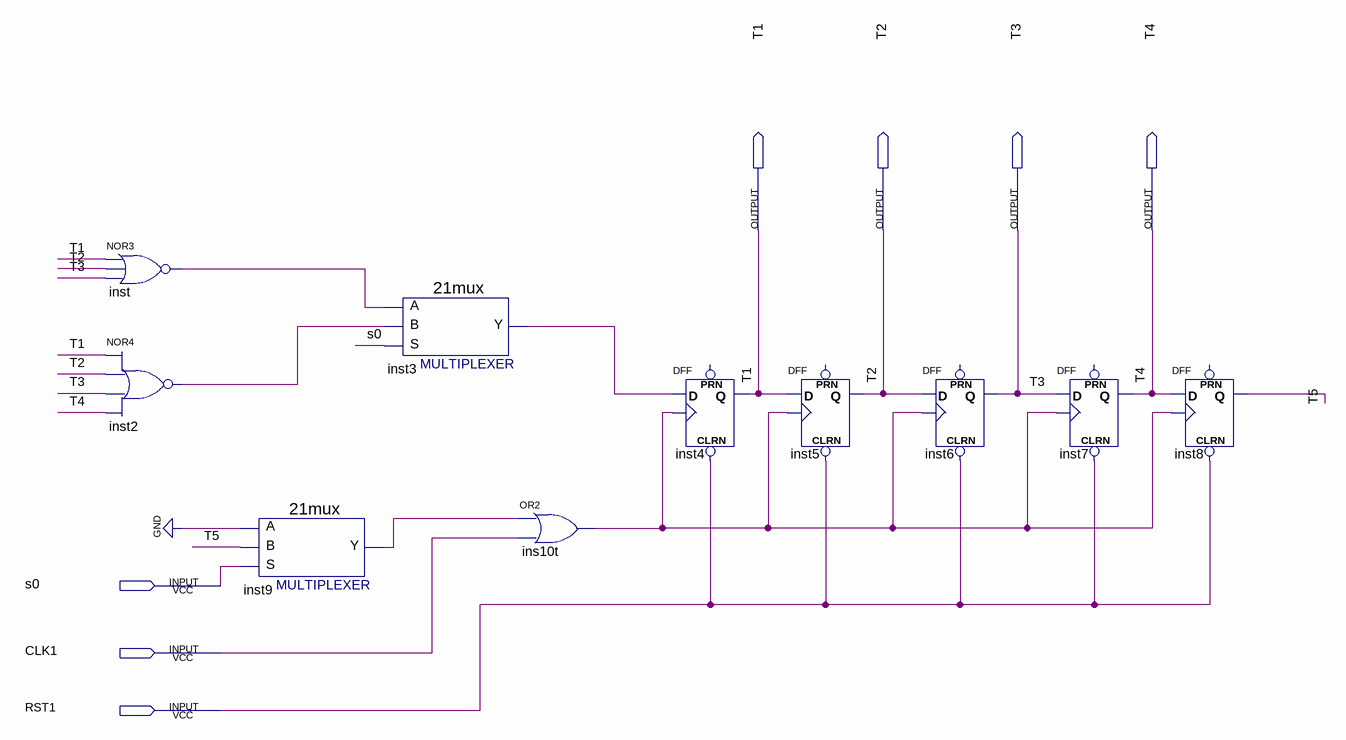
[diagram p0: schematic sheet]
// Quartus schematic Timig2627.bdf as structural Verilog: 10 symbols, 7 pins
module Timig2627 (
  input  s0,
  input  CLK1,
  input  RST1,
  output T1,
  output T2,
  output T3,
  output T4
);

  wire ins10t_out, inst2_out, inst3_y, inst9_y, inst_out, T5;

  nor inst (inst_out, T1, T2, T3);
  nor inst2 (inst2_out, T1, T2, T3, T4);
  \21mux  inst9 (.S(s0), .B(T5), .A(1'b0), .Y(inst9_y));
  \21mux  inst3 (.S(s0), .B(inst2_out), .A(inst_out), .Y(inst3_y));
  or ins10t (ins10t_out, inst9_y, CLK1);
  DFF inst4 (.CLRN(RST1), .CLK(ins10t_out), .D(inst3_y), .Q(T1));  // open: PRN
  DFF inst5 (.CLRN(RST1), .CLK(ins10t_out), .D(T1), .Q(T2));  // open: PRN
  DFF inst6 (.CLRN(RST1), .CLK(ins10t_out), .D(T2), .Q(T3));  // open: PRN
  DFF inst7 (.CLRN(RST1), .CLK(ins10t_out), .D(T3), .Q(T4));  // open: PRN
  DFF inst8 (.CLRN(RST1), .CLK(ins10t_out), .D(T4), .Q(T5));  // open: PRN
endmodule
